# EAGLE schematic Wisp v05 (EAGLE 6.5.0)
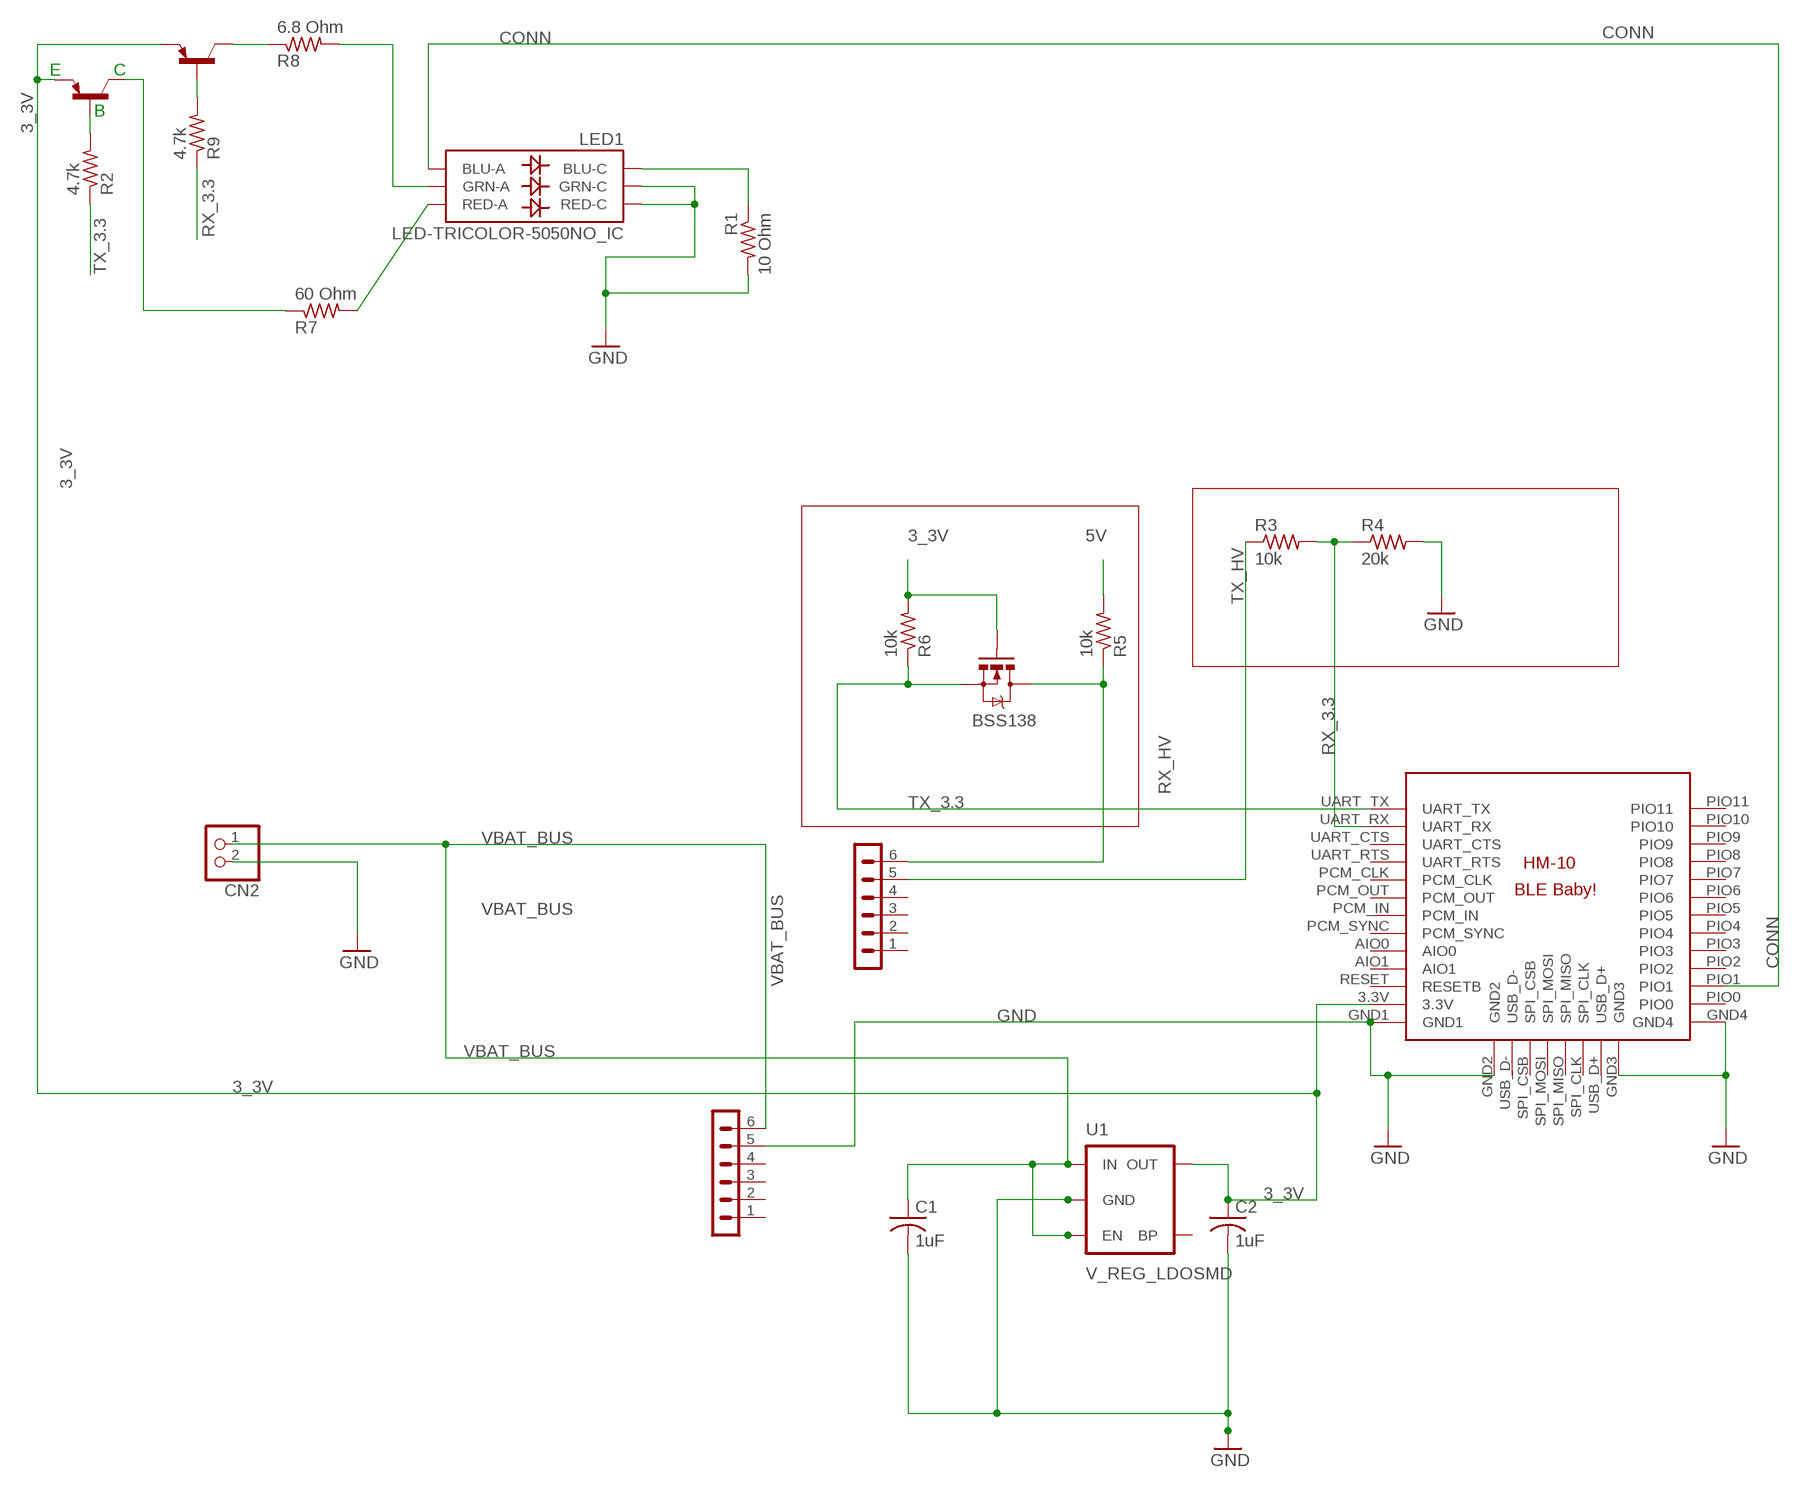
[diagram p0: schematic, sheet 1]

## Parts
BSS138  MOSFET-NCHANNELSMD  [SOT23-3]
C1  1uF  C-USC0805K  [C0805K]
C2  1uF  C-USC0805K  [C0805K]
CN2  JST_2PIN-THM  [JST-PH-2-THM]
LED1  LED-TRICOLOR-5050NO_IC  [LED-TRICOLOR-5050]
R1  10 Ohm  R-US_R0402  [R0402]
R2  4.7k  R-US_R0402  [R0402]
R3  10k  R-US_R0402  [R0402]
R4  20k  R-US_R0402  [R0402]
R5  10k  R-US_R0402  [R0402]
R6  10k  R-US_R0402  [R0402]
R7  60 Ohm  R-US_R0402  [R0402]
R8  6.8 Ohm  R-US_R0402  [R0402]
R9  4.7k  R-US_R0402  [R0402]
T1  -PNP-SOT23-BCE  [SOT23-BCE]
T2  -PNP-SOT23-BCE  [SOT23-BCE]
U1  V_REG_LDOSMD  [SOT23-5]
U$1  BLE-HM-10  [BLE-HM-10]
U$4  1X6_SHORT_ROUND  [1X6_SHORT_ROUND]
U$5  1X6_SHORT_ROUND  [1X6_SHORT_ROUND]

## Nets
3_3V: BSS138.1(G) C2.1 R6.2 T1.E T2.E U1.5(OUT) U$1.3.3V
5V: R5.2
CONN: LED1.3(BLU-A) U$1.PIO1
GND: C1.2 C2.2 CN2.2 LED1.5(RED-C) LED1.6(GRN-C) R1.2 R4.2 U1.2(GND) U$1.GND1 U$1.GND2 U$1.GND3 U$1.GND4 U$5.5
N$1: LED1.2(RED-A) R7.2
N$2: R8.1 T2.C
N$3: R7.1 T1.C
N$4: R2.2 T1.B
N$5: R9.2 T2.B
N$6: LED1.4(BLU-C) R1.1
N$7: LED1.1(GRN-A) R8.2
RX_3.3: R3.2 R4.1 U$1.UART_RX
RX_HV: BSS138.3(D) R5.1 U$4.6
TX_3.3: BSS138.2(S) R6.1 U$1.UART_TX
TX_HV: R3.1 U$4.5
VBAT_BUS: C1.1 CN2.1 U1.1(IN) U1.3(EN) U$5.6
Unconnected: R2.1 R9.1 U1.4(BP) U$1.AIO0 U$1.AIO1 U$1.PCM_CLK U$1.PCM_IN U$1.PCM_OUT U$1.PCM_SYNC U$1.PIO0 U$1.PIO2 U$1.PIO3 U$1.PIO4 U$1.PIO5 U$1.PIO6 U$1.PIO7 U$1.PIO8 U$1.PIO9 U$1.PIO10 U$1.PIO11 U$1.RESET(RESETB) U$1.SPI_CLK U$1.SPI_CSB U$1.SPI_MISO U$1.SPI_MOSI U$1.UART_CTS U$1.UART_RTS U$1.USB_D+ U$1.USB_D- U$4.1 U$4.2 U$4.3 U$4.4 U$5.1 U$5.2 U$5.3 U$5.4

## Notes on the sheet
- E | C
- B

## Library data of the parts
BSS138 = SparkFun:MOSFET-NCHANNEL
C1 C2 = resistor:C-US: CAPACITOR, American symbol
CN2 = adafruit:JST_2PIN: JST 2-Pin Connectors of various flavors SMT-RA (S2B-PH-SM4) 4UConnector #17311 SMT (B2B-PH-SM4) THM-RA (S2B-PH) THM (B2B-PH)
LED1 = SparkFun-LED:LED-TRICOLOR-5050
R1-R9 = resistor:R-US_: RESISTOR, American symbol
T1 T2 = transistor:*-PNP-: PNP Transistror
U1 = SparkFun:V_REG_LDO: Voltage Regulator LDO Standard 150mA LDO voltage regulator in SOT-23 layout. Micrel part MIC5205. BP (by-pass) pin is used to lower output noise with 470pF cap.
U$1 = Random parts:BLE-HM-10
U$4 U$5 = Random parts(01-14-14):1X6_SHORT_ROUND